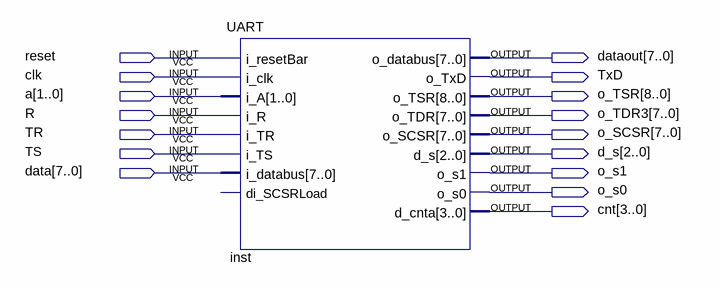
[diagram p0: schematic sheet]
// Quartus schematic Block1.bdf as structural Verilog: 1 symbols, 16 pins
module Block1 (
  input  reset,
  input  clk,
  input  [1:0] a,
  input  R,
  input  TR,
  input  TS,
  input  [7:0] data,
  output [7:0] dataout,
  output TxD,
  output [8:0] o_TSR,
  output [7:0] o_TDR3,
  output [7:0] o_SCSR,
  output [2:0] d_s,
  output o_s1,
  output o_s0,
  output [3:0] cnt
);

  UART inst (
    .i_resetBar(reset), .i_clk(clk), .i_A(a), .i_R(R), .i_TR(TR), .i_TS(TS), .i_databus(data),
    .o_databus(dataout), .o_TxD(TxD), .o_TSR(o_TSR), .o_TDR(o_TDR3), .o_SCSR(o_SCSR), .d_s(d_s), .o_s1(o_s1),
    .o_s0(o_s0), .d_cnta(cnt));  // open: di_SCSRLoad
endmodule
